# Altium schematic sheet 3 RF Source.SchDoc: RF Source
size A3; PageSetup: Record=PageOptions|CenterHorizontal=True|CenterVertical=True|PrintScale=1.01|XCorrection=1.00|YCorrection=1.00|PrintKind=2|BorderSize=5000000|LeftOffset=0|BottomOffset=0|Orientation=2|PaperLength=1000|PaperWidth=1000|Scale=100|PaperSource=15|PrintQuality=600|MediaType=1|DitherType=10|PaperKind=A3|PrintScaleMode=1; DocumentNumber: 4; SheetNumber: 4; SheetTotal: 7
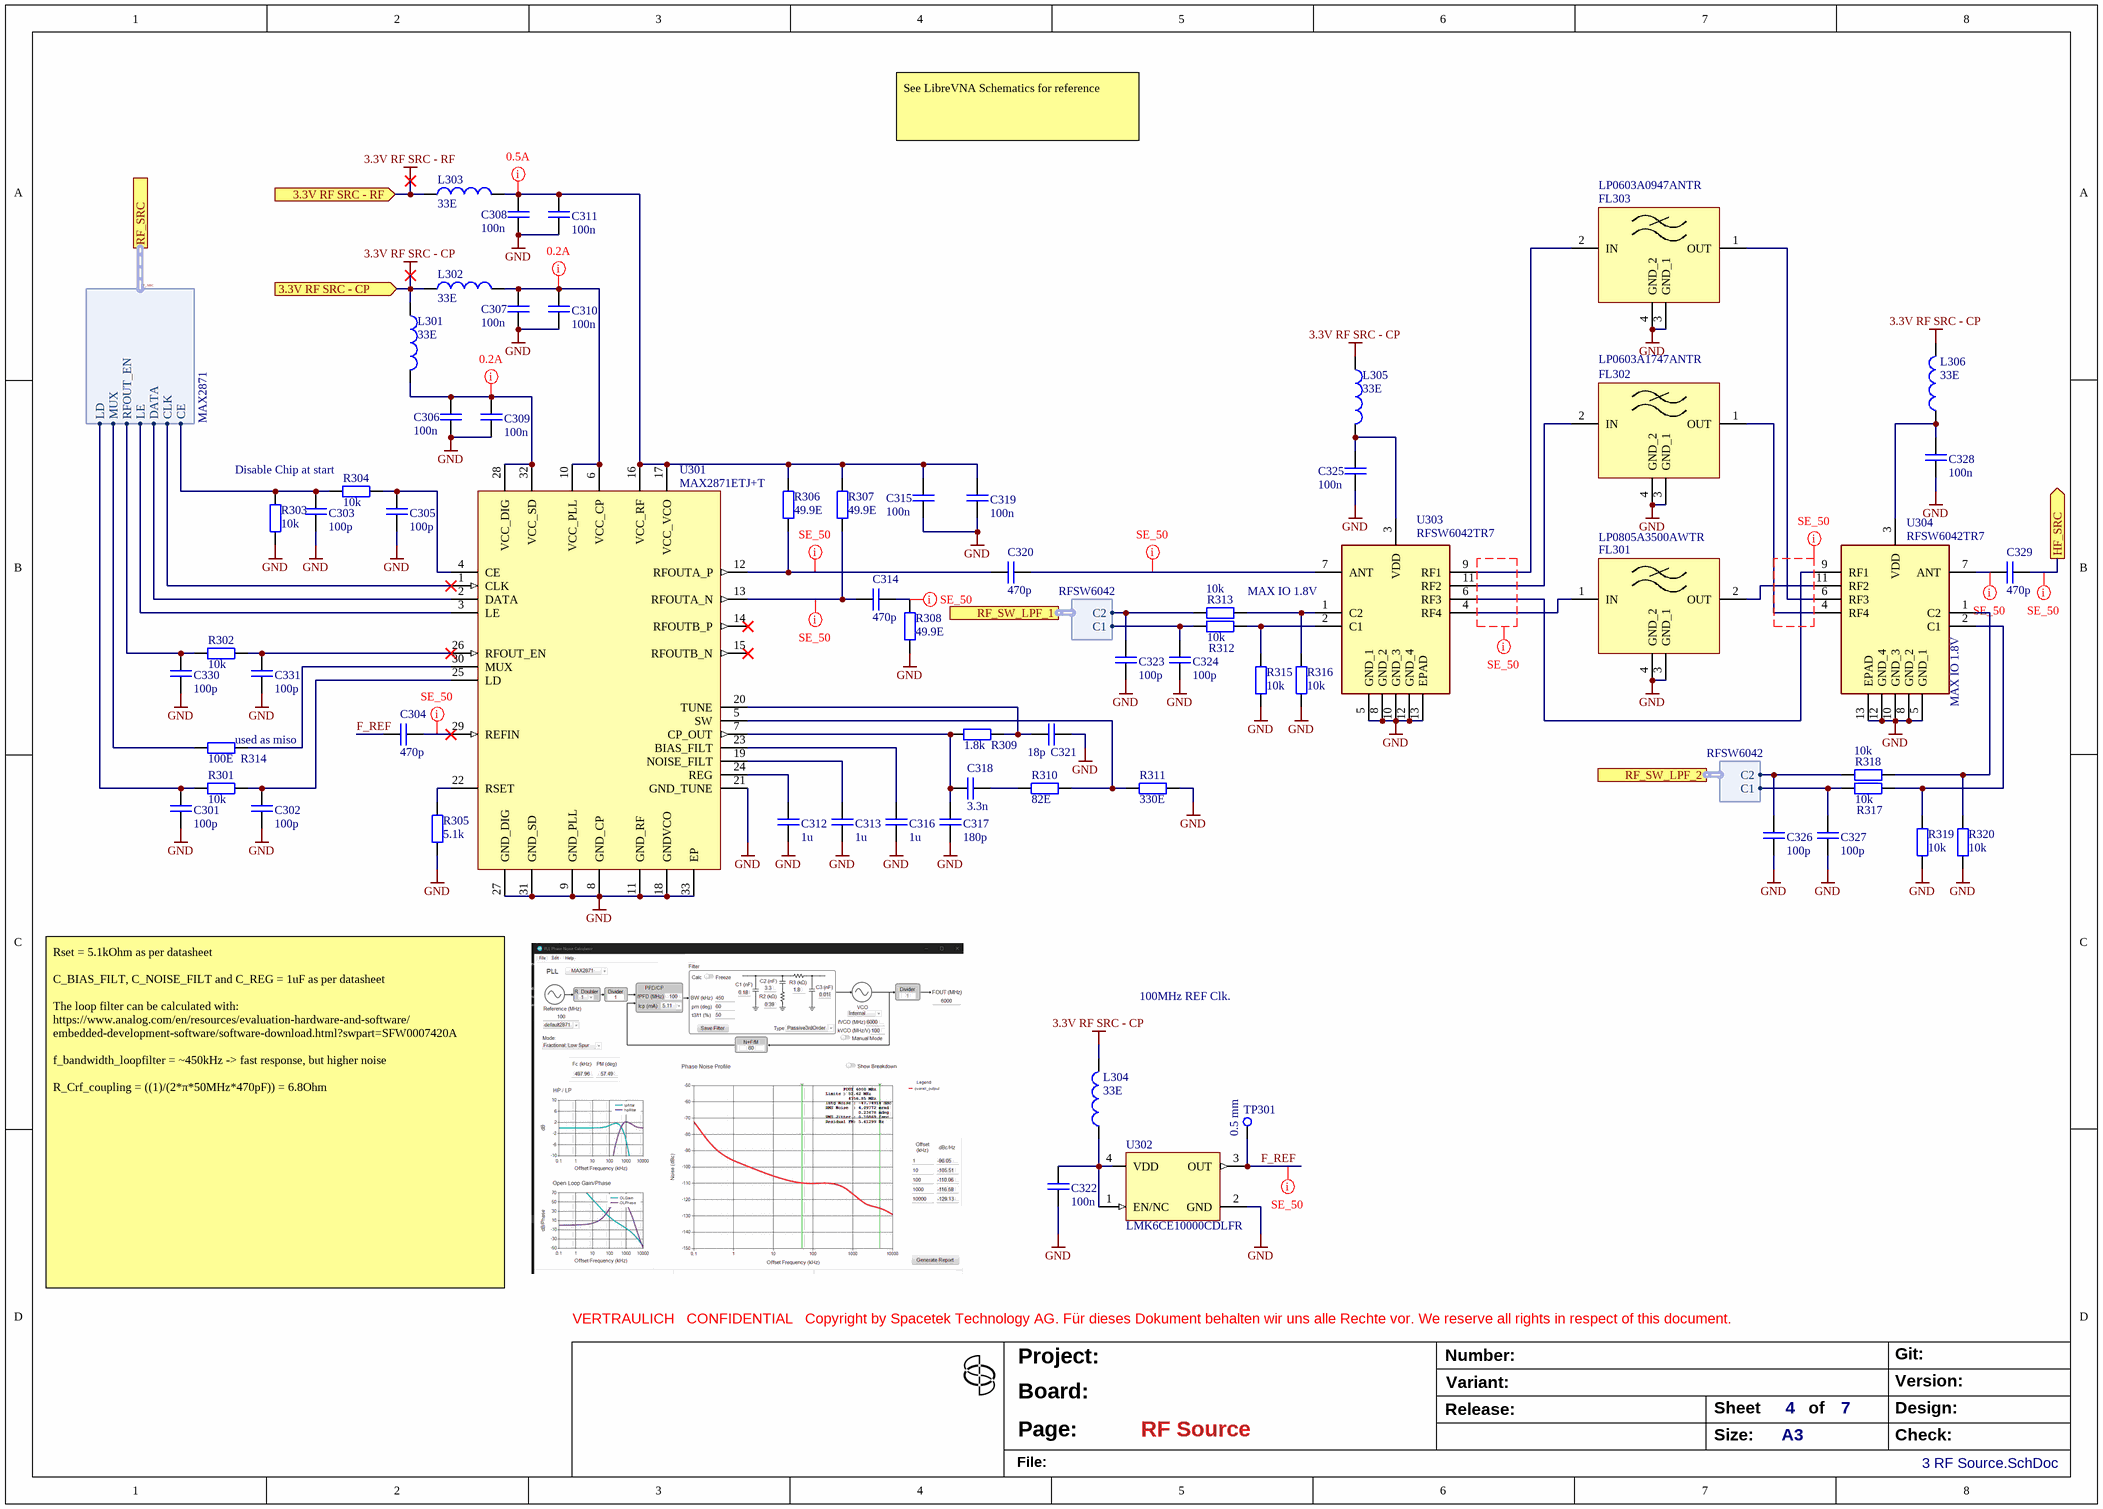
[diagram p0: 3 RF Source.SchDoc]

## Parts
C301  100p  [STT--CC--0402]
C302  100p  [STT--CC--0402]
C303  100p  [STT--CC--0402]
C304  470p  [STT--CC--0402]
C305  100p  [STT--CC--0402]
C306  100n  [STT--CC--0402]
C307  100n  [STT--CC--0402]
C308  100n  [STT--CC--0402]
C309  100n  [STT--CC--0402]
C310  100n  [STT--CC--0402]
C311  100n  [STT--CC--0402]
C312  1u  [STT--CC--0603]
C313  1u  [STT--CC--0603]
C314  470p  [STT--CC--0402]
C315  100n  [STT--CC--0402]
C316  1u  [STT--CC--0603]
C317  180p  [STT--CC--0402]
C318  3.3n  [STT--CC--0402]
C319  100n  [STT--CC--0402]
C320  470p  [STT--CC--0402]
C321  18p  [STT--CC--0402]
C322  100n  [STT--CC--0402]
C323  100p  [STT--CC--0402]
C324  100p  [STT--CC--0402]
C325  100n  [STT--CC--0402]
C326  100p  [STT--CC--0402]
C327  100p  [STT--CC--0402]
C328  100n  [STT--CC--0402]
C329  470p  [STT--CC--0402]
C330  100p  [STT--CC--0402]
C331  100p  [STT--CC--0402]
FL301  LP0805A3500AWTR  [KA--LP0805A]
FL302  LP0603A1747ANTR  [KA--LP0603A]
FL303  LP0603A0947ANTR  [KA--LP0603A]
L301  33E  [STT--FB--0402]
L302  33E  [STT--FB--0402]
L303  33E  [STT--FB--0402]
L304  33E  [STT--FB--0402]
L305  33E  [STT--FB--0402]
L306  33E  [STT--FB--0402]
R301  10k  [STT--RC--0402]
R302  10k  [STT--RC--0402]
R303  10k  [STT--RC--0402]
R304  10k  [STT--RC--0402]
R305  5.1k  [STT--RC--0402]
R306  49.9E  [STT--RC--0402]
R307  49.9E  [STT--RC--0402]
R308  49.9E  [STT--RC--0402]
R309  1.8k  [STT--RC--0402]
R310  82E  [STT--RC--0402]
R311  330E  [STT--RC--0402]
R312  10k  [STT--RC--0402]
R313  10k  [STT--RC--0402]
R314  100E  [STT--RC--0402]
R315  10k  [STT--RC--0402]
R316  10k  [STT--RC--0402]
R317  10k  [STT--RC--0402]
R318  10k  [STT--RC--0402]
R319  10k  [STT--RC--0402]
R320  10k  [STT--RC--0402]
TP301  0.5 mm  [STT--DO--TP-0.5]  (no BOM)
U301  MAX2871ETJ+T  [AD-IC-MAX2871ETJ+T]
U302  LMK6CE10000CDLFR  [TXI-IC-LMK6CE10000CDLFR]
U303  RFSW6042TR7  [QV--IC--QFN-12]
U304  RFSW6042TR7  [QV--IC--QFN-12]

## Ports
3.3V RF SRC - CP (in), 3.3V RF SRC - RF (in), HF_SRC (out), RF_SRC (harness MAX2871), RF_SW_LPF_1 (harness RFSW6042), RF_SW_LPF_2 (harness RFSW6042)

## Harnesses
RFSW6042: C1, C2
MAX2871: CE, CLK, DATA, LE, RFOUT_EN, MUX, LD

## Nets
3.3V RF SRC - CP: L301.1 L302.1 L304.2 L305.1 L306.1 ; port 3.3V RF SRC - CP
3.3V RF SRC - RF: L303.1 ; port 3.3V RF SRC - RF
GND: C301.1 C302.1 C303.1 C305.1 C306.2 C307.2 C308.2 C309.2 C310.2 C311.2 C312.1 C313.1 C315.2 C316.1 C317.1 C319.2 C321.2 C322.1 C323.1 C324.1 C325.2 C326.1 C327.1 C328.2 C330.1 C331.1 FL301.3(GND_1) FL301.4(GND_2) FL302.3(GND_1) FL302.4(GND_2) FL303.3(GND_1) FL303.4(GND_2) R303.2 R305.1 R308.1 R311.2 R315.2 R316.2 R319.2 R320.2 U301.8(GND_CP) U301.9(GND_PLL) U301.11(GND_RF) U301.18(GNDVCO) U301.21(GND_TUNE) U301.27(GND_DIG) U301.31(GND_SD) U301.33(EP) U302.2(GND) U303.5(GND_1) U303.8(GND_2) U303.10(GND_3) U303.12(GND_4) U303.13(EPAD) U304.5(GND_1) U304.8(GND_2) U304.10(GND_3) U304.12(GND_4) U304.13(EPAD)
F_REF: C304.1 TP301.1 U302.3(OUT)
HF_SRC: C329.2 ; port HF_SRC
RF_SRC.CE: C303.2 R303.1 R304.2 ; port RF_SRC.CE
RF_SRC.CLK: U301.1(CLK) ; port RF_SRC.CLK
RF_SRC.DATA: U301.2(DATA) ; port RF_SRC.DATA
RF_SRC.LD: C301.2 R301.2 ; port RF_SRC.LD
RF_SRC.LE: U301.3(LE) ; port RF_SRC.LE
RF_SRC.MUX: R314.1 ; port RF_SRC.MUX
RF_SRC.RFOUT_EN: C330.2 R302.2 ; port RF_SRC.RFOUT_EN
RF_SW_LPF_1.C1: C324.2 R312.1 ; port RF_SW_LPF_1.C1
RF_SW_LPF_1.C2: C323.2 R313.1 ; port RF_SW_LPF_1.C2
RF_SW_LPF_2.C1: C327.2 R317.1 ; port RF_SW_LPF_2.C1
RF_SW_LPF_2.C2: C326.2 R318.1 ; port RF_SW_LPF_2.C2
NetC302_2: C302.2 R301.1 U301.25(LD)
NetC304_2: C304.2 U301.29(REFIN)
NetC305_2: C305.2 R304.1 U301.4(CE)
NetC306_1: C306.1 C309.1 L301.2 U301.28(VCC_DIG) U301.32(VCC_SD)
NetC307_1: C307.1 C310.1 L302.2 U301.6(VCC_CP) U301.10(VCC_PLL)
NetC308_1: C308.1 C311.1 C315.1 C319.1 L303.2 R306.2 R307.2 U301.16(VCC_RF) U301.17(VCC_VCO)
NetC312_2: C312.2 U301.24(REG)
NetC313_2: C313.2 U301.19(NOISE_FILT)
NetC314_1: C314.1 R307.1 U301.13(RFOUTA_N)
NetC314_2: C314.2 R308.2
NetC316_2: C316.2 U301.23(BIAS_FILT)
NetC317_2: C317.2 C318.1 R309.1 U301.7(CP_OUT)
NetC318_2: C318.2 R310.2
NetC320_1: C320.1 R306.1 U301.12(RFOUTA_P)
NetC320_2: C320.2 U303.7(ANT)
NetC321_1: C321.1 R309.2 U301.20(TUNE)
NetC322_2: C322.2 L304.1 U302.1(EN/NC) U302.4(VDD)
NetC325_1: C325.1 L305.2 U303.3(VDD)
NetC328_1: C328.1 L306.2 U304.3(VDD)
NetC329_1: C329.1 U304.7(ANT)
NetC331_2: C331.2 R302.1 U301.26(RFOUT_EN)
NetFL301_1: FL301.1(IN) U303.4(RF4)
NetFL301_2: FL301.2(OUT) U304.11(RF2)
NetFL302_1: FL302.1(OUT) U304.4(RF4)
NetFL302_2: FL302.2(IN) U303.11(RF2)
NetFL303_1: FL303.1(OUT) U304.6(RF3)
NetFL303_2: FL303.2(IN) U303.9(RF1)
NetR305_2: R305.2 U301.22(RSET)
NetR310_1: R310.1 R311.1 U301.5(SW)
NetR312_2: R312.2 R315.1 U303.2(C1)
NetR313_2: R313.2 R316.1 U303.1(C2)
NetR314_2: R314.2 U301.30(MUX)
NetR317_2: R317.2 R319.1 U304.2(C1)
NetR318_2: R318.2 R320.1 U304.1(C2)
NetU303_6: U303.6(RF3) U304.9(RF1)

Not connected (* = marked no-connect by the designer): U301 14(RFOUTB_P)* 15(RFOUTB_N)*

## Buses and harness runs
harness RF_SRC = port RF_SRC
harness RF_SW_LPF_1 = port RF_SW_LPF_1
harness RF_SW_LPF_2 = port RF_SW_LPF_2

## Layout directives
net class SE_50: (no net found under the mark), F_REF, HF_SRC, NetC304_2, NetC314_1, NetC314_2, NetC320_1, NetC320_2, NetC329_1
net class 0.5A: NetC308_1
net class 0.2A: NetC306_1, NetC307_1

## Notes on the sheet
- See LibreVNA Schematics for reference
- (near R304) Disable Chip at start
- MAX IO 1.8V
- (near U304) MAX IO 1.8V
- (near R314) used as miso
- 100MHz REF Clk.
- Rset = 5.1kOhm as per datasheet
  C_BIAS_FILT, C_NOISE_FILT and C_REG = 1uF as per datasheet
  The loop filter can be calculated with:
  https://www.analog.com/en/resources/evaluation-hardware-and-software/
  embedded-development-software/software-download.html?swpart=SFW0007420A
  f_bandwidth_loopfilter = ~450kHz -> fast response, but higher noise
  R_Crf_coupling = ((1)/(2*π*50MHz*470pF)) = 6.8Ohm
- VERTRAULICH   CONFIDENTIAL   Copyright by Spacetek Technology AG. Für dieses Dokument behalten wir uns alle Rechte vor. We reserve all rights in respect of this document.
- Project:
- Number:
- Variant:
- Version:
- Git:
- Board:
- Page:
- Release:
- Size:
- Sheet
- A3
- of
- Design:
- Check:
- File:

## Library data of the parts
C301-C303 C305 C323 C324 C326 C327 C330 C331 = CMP-010-000109-1: Capacitor ceramic 100p 50V 5% C0G AEC-Q200 SMD--0402; Partnumber: CL05C101JB51PND; Manufacturer: Samsung Electro-Mechanics; Component Category: Generic; Meta Data Version: v1.0; Package: SMD--0402; Status: released; Type: Capacitor ceramic; Value: 100p
C304 C314 C320 C329 = CMP-010-000105-1: Capacitor ceramic 470p 50V 5% C0G  SMD--0402; Manufacturer: TDK; Partnumber: CGA2B2C0G1H471J050BA; Component Category: Generic; Meta Data Version: v1.0; Status: released; Value: 470p
C306-C311 C315 C319 C322 C325 C328 = 200032-3: Capacitor ceramic 100n 16V 10% X7R  SMD--0402; Partnumber: CL05B104KO5NNNC; Manufacturer: Samsung Electro-Mechanics; A-Number: 200032; Material: X7R; Voltage: 16V; Type: Capacitor ceramic; Tolerance: 10%; Status: released; Package: SMD--0402; Value: 100n
C312 C313 C316 = CMP-010-000042-2: CAP CER 1UF 35V X7R 0603 10%; Manufacturer: TDK Corporation; Partnumber: C1608X7R1V105K080AC; Special: 0603 SMD; Value: 1u; E-Nummer: -; Status: released
C317 = CMP-010-000104-2: Capacitor ceramic 180p 50V 5% C0G  SMD--0402; Partnumber: CL05C181JB5NNNC; Manufacturer: Samsung Electro-Mechanics; Component Category: Generic; Meta Data Version: v1.0; Value: 180p; Tolerance: 5%; Status: released; Type: Capacitor ceramic; Voltage: 50V; Material: C0G; Package: SMD--0402
C318 = CMP-010-000108-1: Capacitor ceramic 3.3n 50V 10% X7R AEC-Q200 SMD--0402; Partnumber: CL05B332KB5VPNC; Manufacturer: Samsung Electro-Mechanics; Component Category: Generic; Meta Data Version: v1.0; Package: SMD--0402; Status: released; Value: 3.3n; Type: Capacitor ceramic
C321 = 200042-1: Capacitor ceramic 18p 50V 5% C0G  SMD--0402; Partnumber: CL05C180JB5NNNC; Manufacturer: Samsung Electro-Mechanics; A-Number: 200042; Voltage: 50V; Type: Capacitor ceramic; Tolerance: 5%; Package: SMD--0402; Material: C0G; Status: released; Value: 18p
FL301 = CMP-011-000006-1: Low Pass Filter 3500MHz 50 Ohms; Manufacturer: KYOCERA AVX; Component Category: Generic; Meta Data Version: v1.0; Partnumber: LP0805A3500AWTR; Value: LP0805A3500AWTR; Status: released
FL302 = CMP-011-000005-4: Low Pass Filter 1747MHz 50 Ohms; Manufacturer: KYOCERA AVX; Component Category: Generic; Meta Data Version: v1.0; Partnumber: LP0603A1747ANTR; Status: released; Value: LP0603A1747ANTR
FL303 = CMP-011-000007-2: Low Pass Filter 947MHz 50 Ohms; Manufacturer: KYOCERA AVX; Component Category: Generic; Meta Data Version: v1.0; Partnumber: LP0603A0947ANTR; Value: LP0603A0947ANTR; Status: released
L301-L306 = 300015-1: Ferrit Bead MPZ1005S330HT000 33E 3A 22mE SMD--0402; Manufacturer: TDK Group; preferred: Yes; A-Number: 300015; Status: active; Current: 3A; Type: Ferrit Bead; Value: 33E; Package: MPZ1005S330HT000; Special: 22mE; Partnumber: MPZ1005S330HT000
R301-R304 R312 R313 R315-R320 = 100086-1: Resistor 10k 50V  0.063W 1%  SMD--0402; Partnumber: ERJ-2RKF1002X; Manufacturer: Panasonic; A-Number: 100086; Power: 0.063W; Status: released; Type: Resistor; Voltage: 50V; Tolerance: 1%; Value: 10k; Package: SMD--0402
R305 = CMP-009-000042-2: Resistor 5.1k 50V  0.063W 1%  SMD--0402; Partnumber: ERJ-2RKF5101X; Manufacturer: Panasonic; Value: 5.1k; Tolerance: 1%; Package: SMD--0402; Power: 0.063W; Status: released; Voltage: 50V; Type: Resistor
R306-R308 = CMP-009-000262-1: Resistor 49.9E 50V 0.1W 1% SMD--0402; Partnumber: RNCP0402FTD49R9; Manufacturer: SEI Stackpole; Component Category: Generic; Meta Data Version: v1.0; Value: 49.9E; Status: released
R309 = CMP-009-000258-1: Resistor 1.8k 50V  0.063W 1%  SMD--0402; Manufacturer: SEI Stackpole; Partnumber: RMCF0402FT1K80; Component Category: Generic; Meta Data Version: v1.0; Power: 0.063W; Package: SMD--0402; Value: 1.8k; Voltage: 50V; Type: Resistor; Tolerance: 1%; Status: released
R310 = CMP-009-000257-2: Resistor 82E 25V  0.063W 0.5%  SMD--0402; Partnumber: RR0510R-820-D; Manufacturer: Vishay; Meta Data Version: v1.0; Component Category: Generic; Type: Resistor; Status: released; Value: 82E
R311 = 100076-2: Resistor 330E 50V  0.063W 1%  SMD--0402; Partnumber: ERJ-2RKF3300X; Manufacturer: Panasonic; A-Number: 100076; Power: 0.063W; Type: Resistor; Voltage: 50V; Value: 330E; Package: SMD--0402; Tolerance: 1%; Status: released
R314 = 100068-1: Resistor 100E 50V  0.063W 0.01  SMD--0402; Partnumber: CRCW0402100RFKEDC; Manufacturer: Vishay; A-Number: 100068; Tolerance: 0.01; Power: 0.063W; Package: SMD--0402; Value: 100E; Status: released; Type: Resistor; Voltage: 50V
TP301 = CMP-043-000000-4: Pad TP SMD--Pad 0.5; Special: 0.5; preferred: Yes; Status: active; Partnumber: TP; Value: 0.5 mm; Package: SMD--Pad; Type: Pad
U301 = CMP-038-000007-2: MAX2871ETJ+T PLL 23.5MHz to 6000MHz; Manufacturer: Analog Devices; Meta Data Version: v1.0; Component Category: generic; Type: Oscillator; Partnumber: MAX2871ETJ+T; Status: released; Value: 23.5MHz to 6000MHz
U302 = CMP-038-000005-2: LMK6CE10000CDLFR low jitter 100MHz 3.3V LVCMOS, no load max.: 62mA; Manufacturer: Texas Instruments; Meta Data Version: Meta Data Version v1.0; Voltage: 2.5V - 3.3 V; Component Category: Generic; Value: 100 MHz; Special: LVCMOS; Type: Oscillator; Status: released; Partnumber: LMK6CE10000CDLFR
U303 U304 = CMP-081-000011-1: RF Switch RFSW6042TR7  5-6000MHz SP4T Iso 36dB @925MHz; Manufacturer: Qorvo; Component Category: Generic; Meta Data Version: v1.0; Partnumber: RFSW6042TR7; Status: released; Value: RFSW6042TR7; Type: RF-Switch